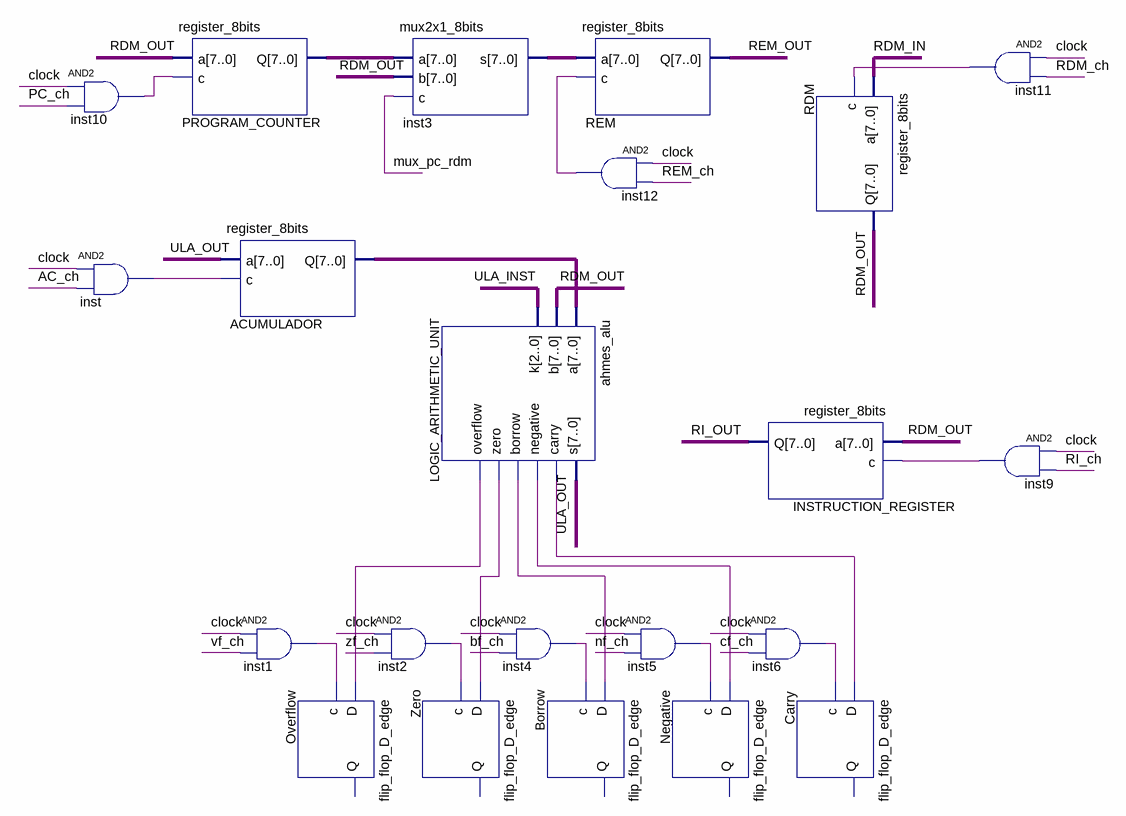
[diagram p0: schematic sheet]
// Quartus schematic Ahmes.bdf as structural Verilog: 22 symbols, 0 pins
module Ahmes (
);

  wire AC_ch, bf_ch, cf_ch, clock, inst1_out, inst2_out, inst4_out, inst5_out, inst6_out, inst9_out,
       inst10_out, inst11_out, inst12_out, inst_out, LOGIC_ARITHMETIC_UNIT_borrow,
       LOGIC_ARITHMETIC_UNIT_carry, LOGIC_ARITHMETIC_UNIT_negative, LOGIC_ARITHMETIC_UNIT_overflow,
       LOGIC_ARITHMETIC_UNIT_zero, mux_pc_rdm, nf_ch, PC_ch, RDM_ch, RDM_IN, RDM_OUT, REM_ch, REM_OUT, RI_ch,
       RI_OUT, ULA_INST, ULA_OUT, vf_ch, zf_ch;
  wire [7:0] ACUMULADOR_q, inst3_s, PROGRAM_COUNTER_q;

  and inst10 (inst10_out, clock, PC_ch);
  and inst (inst_out, clock, AC_ch);
  register_8bits PROGRAM_COUNTER (.a({8{RDM_OUT}}), .c(inst10_out), .Q(PROGRAM_COUNTER_q));
  register_8bits ACUMULADOR (.a({8{ULA_OUT}}), .c(inst_out), .Q(ACUMULADOR_q));
  and inst1 (inst1_out, clock, vf_ch);
  flip_flop_D_edge Overflow (.D(LOGIC_ARITHMETIC_UNIT_overflow), .c(inst1_out));  // open: Q
  mux2x1_8bits inst3 (.a(PROGRAM_COUNTER_q), .b({8{RDM_OUT}}), .c(mux_pc_rdm), .s(inst3_s));
  and inst2 (inst2_out, clock, zf_ch);
  flip_flop_D_edge Zero (.D(LOGIC_ARITHMETIC_UNIT_zero), .c(inst2_out));  // open: Q
  ahmes_alu LOGIC_ARITHMETIC_UNIT (
    .a(ACUMULADOR_q), .b({8{RDM_OUT}}), .k({3{ULA_INST}}), .s(ULA_OUT), .carry(LOGIC_ARITHMETIC_UNIT_carry),
    .negative(LOGIC_ARITHMETIC_UNIT_negative), .borrow(LOGIC_ARITHMETIC_UNIT_borrow),
    .zero(LOGIC_ARITHMETIC_UNIT_zero), .overflow(LOGIC_ARITHMETIC_UNIT_overflow));
  and inst4 (inst4_out, clock, bf_ch);
  flip_flop_D_edge Borrow (.D(LOGIC_ARITHMETIC_UNIT_borrow), .c(inst4_out));  // open: Q
  register_8bits REM (.a(inst3_s), .c(inst12_out), .Q(REM_OUT));
  and inst12 (inst12_out, clock, REM_ch);
  and inst5 (inst5_out, clock, nf_ch);
  flip_flop_D_edge Negative (.D(LOGIC_ARITHMETIC_UNIT_negative), .c(inst5_out));  // open: Q
  register_8bits RDM (.a({8{RDM_IN}}), .c(inst11_out), .Q(RDM_OUT));
  register_8bits INSTRUCTION_REGISTER (.a({8{RDM_OUT}}), .c(inst9_out), .Q(RI_OUT));
  and inst6 (inst6_out, clock, cf_ch);
  flip_flop_D_edge Carry (.D(LOGIC_ARITHMETIC_UNIT_carry), .c(inst6_out));  // open: Q
  and inst11 (inst11_out, clock, RDM_ch);
  and inst9 (inst9_out, clock, RI_ch);
endmodule
